# EAGLE schematic MCU (EAGLE 9.6.1)
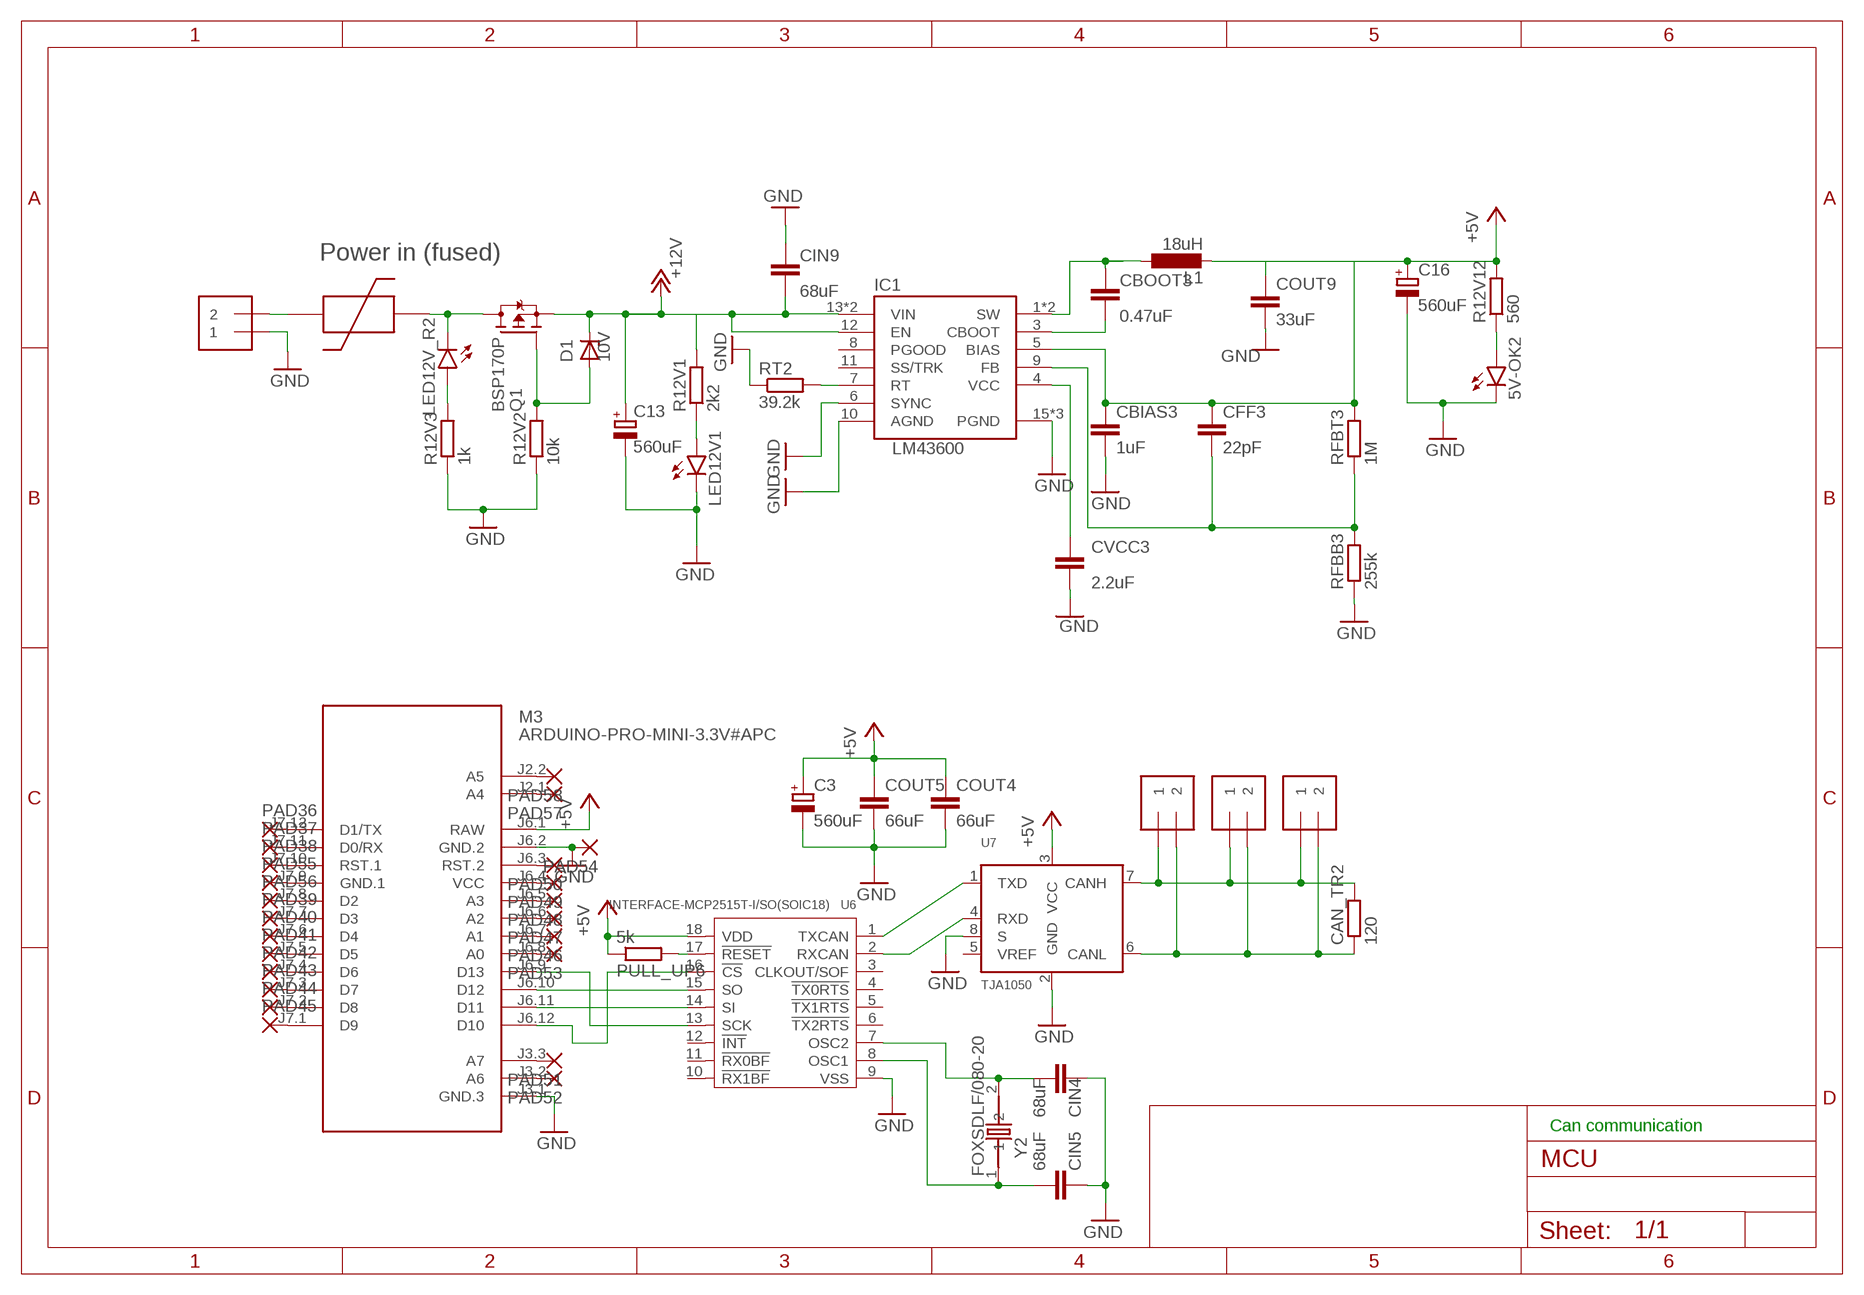
[diagram p0: schematic, sheet 1]

## Parts
5V-OK2  LEDCHIPLED_0805  [CHIPLED_0805]
C3  560uF  CPOL-EUF  [PANASONIC_F]
C13  560uF  CPOL-EUF  [PANASONIC_F]
C16  560uF  CPOL-EUF  [PANASONIC_F]
CAN_TR2  120  R-EU_R0805  [R0805]
CBIAS3  1uF  C-EUC0805  [C0805]
CBOOT3  0.47uF  C-EUC0805  [C0805]
CFF3  22pF  C-EUC0805  [C0805]
CIN4  68uF  C-EUC0805  [C0805]
CIN5  68uF  C-EUC0805  [C0805]
CIN9  68uF  C-EUC0805  [C0805]
COUT4  66uF  C-EUC0805  [C0805]
COUT5  66uF  C-EUC0805  [C0805]
COUT9  33uF  C-EUC0805  [C0805]
CVCC3  2.2uF  C-EUC0805  [C0805]
D1  10V  ZENER-DIODESMB  [SMB]
IC1  LM43600  [HTSSOP16]
J5  1X2-3.5MM  [1X2-3.5MM]
J11  1X2-3.5MM  [1X2-3.5MM]
J12  1X2-3.5MM  [1X2-3.5MM]
J13  1X2-3.5MM  [1X2-3.5MM]
L1  18uH  L-EUL1812  [L1812]
LED12V1  LEDCHIPLED_0805  [CHIPLED_0805]
LED12V_R2  LEDCHIPLED_0805  [CHIPLED_0805]
M3  ARDUINO-PRO-MINI-3.3V#APC  [ARDUINO-PRO-MINI#APC]
PAD36  SMD2  [SMD1,27-2,54]
PAD37  SMD2  [SMD1,27-2,54]
PAD38  SMD2  [SMD1,27-2,54]
PAD39  SMD2  [SMD1,27-2,54]
PAD40  SMD2  [SMD1,27-2,54]
PAD41  SMD2  [SMD1,27-2,54]
PAD42  SMD2  [SMD1,27-2,54]
PAD43  SMD2  [SMD1,27-2,54]
PAD44  SMD2  [SMD1,27-2,54]
PAD45  SMD2  [SMD1,27-2,54]
PAD46  SMD2  [SMD1,27-2,54]
PAD47  SMD2  [SMD1,27-2,54]
PAD48  SMD2  [SMD1,27-2,54]
PAD49  SMD2  [SMD1,27-2,54]
PAD50  SMD2  [SMD1,27-2,54]
PAD51  SMD2  [SMD1,27-2,54]
PAD52  SMD2  [SMD1,27-2,54]
PAD53  SMD2  [SMD1,27-2,54]
PAD54  SMD2  [SMD1,27-2,54]
PAD55  SMD2  [SMD1,27-2,54]
PAD56  SMD2  [SMD1,27-2,54]
PAD57  SMD2  [SMD1,27-2,54]
PAD58  SMD2  [SMD1,27-2,54]
PULL_UP6  5k  R-EU_R0805  [R0805]
Q1  BSP170P  [SOT223]
R12V1  2k2  R-EU_R0805  [R0805]
R12V2  10k  R-EU_R0805  [R0805]
R12V3  1k  R-EU_R0805  [R0805]
R12V12  560  R-EU_R0805  [R0805]
RFBB3  255k  R-EU_R0805  [R0805]
RFBT3  1M  R-EU_R0805  [R0805]
RT2  39.2k  R-EU_R0805  [R0805]
U6  INTERFACE-MCP2515T-I/SO(SOIC18)  [SOIC18-1.27-11.5X7.5MM]
U7  TJA1050  [SOT96-1]
U$2  SMF_OMNI-BLOK_FUSE_BLOCK  [SMF_OMNI-BLOK_FUSE_BLOCK]
Y2  FOXSDLF/080-20  [XTAL1170X500X450]

## Nets
+5V [signal]: C3.+ C16.+ CBIAS3.1 CFF3.1 COUT4.1 COUT5.1 COUT9.1 IC1.5(BIAS) L1.2 M3.J6.1(RAW) PULL_UP6.1 R12V12.2 RFBT3.2 U6.18(VDD) U7.3(VCC)
GND: 5V-OK2.C C3.- C13.- C16.- CBIAS3.2 CIN4.1 CIN5.1 CIN9.1 COUT4.2 COUT5.2 COUT9.2 CVCC3.2 IC1.6(SYNC) IC1.10(AGND) IC1.15(PGND) IC1.16(PGND) IC1.17(PGND) J13.1 LED12V1.C M3.J3.1(GND.3) M3.J6.2(GND.2) PAD54.1(P) R12V2.1 R12V3.1 RFBB3.1 RT2.1 U6.9(VSS) U7.2(GND) U7.8(S)
N$13 [12V]: CIN9.2 IC1.12(EN) IC1.13(VIN) IC1.14(VIN) R12V1.2 ; supply symbol labelled +12V
N$61: M3.J6.10(D12) U6.15(SO)
N$62: M3.J6.11(D11) U6.14(SI)
N$63: M3.J6.12(D10) U6.16(!CS)
N$64: M3.J6.9(D13) U6.13(SCK)
N$104: PULL_UP6.2 U6.17(!RESET)
N$105: U6.1(TXCAN) U7.1(TXD)
N$106: CIN4.2 U6.7(OSC2) Y2.2
N$107: CIN5.2 U6.8(OSC1) Y2.1
N$108: U6.2(RXCAN) U7.4(RXD)
N$109: CAN_TR2.2 J5.1 J11.1 J12.1 U7.7(CANH)
N$110: CAN_TR2.1 J5.2 J11.2 J12.2 U7.6(CANL)
N$111: M3.J7.12(D1/TX) PAD36.1(P)
N$112: M3.J7.11(D0/RX) PAD37.1(P)
N$113: M3.J7.10(RST.1) PAD38.1(P)
N$114: M3.J7.7(D3) PAD39.1(P)
N$115: M3.J7.6(D4) PAD40.1(P)
N$116: M3.J7.5(D5) PAD41.1(P)
N$117: M3.J7.4(D6) PAD42.1(P)
N$118: M3.J7.3(D7) PAD43.1(P)
N$119: M3.J7.2(D8) PAD44.1(P)
N$120: M3.J7.1(D9) PAD45.1(P)
N$121: M3.J6.7(A1) PAD46.1(P)
N$122: M3.J6.6(A2) PAD47.1(P)
N$123: M3.J6.5(A3) PAD48.1(P)
N$124: M3.J6.4(VCC) PAD49.1(P)
N$125: M3.J6.3(RST.2) PAD50.1(P)
N$126: M3.J3.3(A7) PAD51.1(P)
N$127: M3.J3.2(A6) PAD52.1(P)
N$128: M3.J6.8(A0) PAD53.1(P)
N$129: M3.J7.9(GND.1) PAD55.1(P)
N$130: CBOOT3.1 IC1.1(SW) IC1.2(SW) L1.1
N$131: CBOOT3.2 IC1.3(CBOOT)
N$132: LED12V1.A R12V1.1
N$133 [12V]: D1.A Q1.1(G) R12V2.2
N$134: 5V-OK2.A R12V12.1
N$135: J13.2 U$2.PIN1
N$136: LED12V_R2.A R12V3.2
N$137: LED12V_R2.C Q1.2(D) Q1.4(D) U$2.PIN2
N$138: CVCC3.1 IC1.4(VCC)
N$139: IC1.7(RT) RT2.2
N$140: CFF3.2 IC1.9(FB) RFBB3.2 RFBT3.1
N$141 [12V]: C13.+ D1.C Q1.3(S)
N$142: M3.J7.8(D2) PAD56.1(P)
N$143: M3.J2.1(A4) PAD57.1(P)
N$144: M3.J2.2(A5) PAD58.1(P)
Unconnected: IC1.8(PGOOD) IC1.11(SS/TRK) U6.3(CLKOUT/SOF) U6.4(!TX0RTS) U6.5(!TX1RTS) U6.6(!TX2RTS) U6.10(!RX1BF) U6.11(!RX0BF) U6.12(!INT) U7.5(VREF)

## Notes on the sheet
- Power in (fused)
- Can communication

## Library data of the parts
5V-OK2 LED12V1 LED12V_R2 = led:LED: LED OSRAM: - CHIPLED LG R971, LG N971, LY N971, LG Q971, LY Q971, LO R971, LY R971 LH N974, LH R974 LS Q976, LO Q976, LY Q976 LO Q996 - Hyper CHIPLED LW Q18S LB Q993, LB Q99A, LB R99A - SideLED LS A670, LO A670, LY A670, LG A670, LP A670 LB A673, LV A673, LT A673, LW A673 LH A674 LY A675 LS A676, LA A676, LO A676, LY A676, LW A676 LS A679, LY A679, LG A679 - Hyper Micro SIDELED® LS Y876, LA Y876, LO Y876, LY Y876 LT Y87S - SmartLED LW L88C, LW L88S LB L89C, LB L89S, LG L890 LS L89K, LO L89K, LY L89K LS L896, LA L896, LO L896, LY L896 - TOPLED LS T670, LO T670, LY T670, LG T670, LP T670 LSG T670, LSP T670, LSY T670, LOP T670, LYG T670 LG T671, LOG T671, LSG T671 LB T673, LV T673, LT T673, LW T673 LH T674 LS T676, LA T676, LO T676, LY T676, LB T676, LH T676, LSB T676, LW T676 LB T67C, LV T67C, LT T67C, LS T67K, LO T67K, LY T67K, LW E67C LS E67B, LA E67B, LO E67B, LY E67B, LB E67C, LV E67C, LT E67C LW T67C LS T679, LY T679, LG T679 LS T770, LO T770, LY T770, LG T770, LP T770 LB T773, LV T773, LT T773, LW T773 LH T774 LS E675, LA E675, LY E675, LS T675 LS T776, LA T776, LO T776, LY T776, LB T776 LHGB T686 LT T68C, LB T68C - Hyper Mini TOPLED® LB M676 - Mini TOPLED Santana® LG M470 LS M47K, LO M47K, LY M47K Source: http://www.osram.convergy.de LUXEON: - LUMILED® LXK2-PW12-R00, LXK2-PW12-S00, LXK2-PW14-U00, LXK2-PW14-V00 LXK2-PM12-R00, LXK2-PM12-S00, LXK2-PM14-U00 LXK2-PE12-Q00, LXK2-PE12-R00, LXK2-PE12-S00, LXK2-PE14-T00, LXK2-PE14-U00 LXK2-PB12-K00, LXK2-PB12-L00, LXK2-PB12-M00, LXK2-PB14-N00, LXK2-PB14-P00, LXK2-PB14-Q00 LXK2-PR12-L00, LXK2-PR12-M00, LXK2-PR14-Q00, LXK2-PR14-R00 LXK2-PD12-Q00, LXK2-PD12-R00, LXK2-PD12-S00 LXK2-PH12-R00, LXK2-PH12-S00 LXK2-PL12-P00, LXK2-PL12-Q00, LXK2-PL12-R00 Source: www.luxeon.com KINGBRIGHT: KA-3528ASYC Source: www.kingbright.com
C3 C13 C16 = rcl:CPOL-EU: POLARIZED CAPACITOR, European symbol; SPICEPREFIX: C
CAN_TR2 PULL_UP6 R12V1-R12V3 R12V12 RFBB3 RFBT3 RT2 = rcl:R-EU_: RESISTOR, European symbol; SPICEPREFIX: R
CBIAS3 CBOOT3 CFF3 CIN4 CIN5 CIN9 COUT4 COUT5 COUT9 CVCC3 = rcl:C-EU: CAPACITOR, European symbol; SPICEPREFIX: C
D1 = diode:ZENER-DIODE: Z-Diode
IC1 = texas-lm43600:LM43600: The LM43600 SIMPLE SWITCHER® regulator is an easy to use synchronous step-down DC-DC converter capable of driving up to 0.5 A of load current from an input voltage ranging from 3.5 V to 36 V (42 V transient). The LM43600 provides exceptional efficiency, output accuracy and drop-out voltage in a very small solution size. The library has been designed by Richard Magdycz <https://www.facebook.com/groups/eaglecadsoftUK>
J5 J11-J13 = adafruit:1X2: 3.5mm Terminal block http://www.ladyada.net/library/pcb/eaglelibrary.html
L1 = rcl:L-EU: INDUCTOR, European symbol; SPICEPREFIX: L
M3 = diy-modules:ARDUINO-PRO-MINI-*#APC: Arduino Pro Mini (and compatible devices) with angle programming connector More details available here: https://www.arduino.cc/en/Main/ArduinoBoardProMini Click here to find device on ebay.com <http://www.ebay.com/sch/arduino+pro+mini>
PAD36-PAD58 = wirepad:SMD2: SMD PAD
Q1 = transistor-fet:BSP170P: SIPMOS(R) Small-Signal-Transistor P-Channel, Enhancement mode Source: http://www.infineon.com/upload/Document/BSP170P_Rev2.4.pdf
U6 = INTERFACE-MCP2515T-I_SO_SOIC18_:INTERFACE-MCP2515T-I/SO(SOIC18): 310070025; AVAILABILITY: Unavailable; DESCRIPTION: CANbus Controller CAN 2.0 SPI Interface 18-SOIC; MF: Microchip; MP: MCP2515T-I/SO; PACKAGE: SOIC-18 Microchip; PRICE: None
U7 = TJA1050:TJA1050: High speed CAN transceiver The TJA1050 is the interface between the Controller Area Network (CAN) protocol controller and the physical bus. The device provides differential transmit capability to the bus and differential receive capability to the CAN controller. The TJA1050 is the third Philips high-speed CAN transceiver after the PCA82C250 and the PCA82C251. The most important differences are: Much lower electromagnetic emission due to optimal matching of the output signals CANH and CANL Improved behaviour in case of an unpowered node No standby mode. This makes the TJA1050 eminently suitable for use in nodes that are in a power-down situation in partially powered networks. AAL Eindhoven MK; AVAILABILITY: Unavailable; DESCRIPTION: 1/1 Transceiver Half CANbus 8-SO; MF: NXP USA; MP: TJA1050; PACKAGE: SOIC-8 NXP USA; PRICE: None
U$2 = SMF_OMNI-BLOK_FUSE_BLOCK:SMF_OMNI-BLOK_FUSE_BLOCK
Y2 = FOXSDLF_080-20:FOXSDLF/080-20: Crystal 8MHz 30ppm (Tol) 50ppm (Stability) 20pF FUND 80Ohm 2-Pin HC-49/SDLF SMD T/R; AVAILABILITY: Unavailable; DESCRIPTION: 8MHz ±30ppm Crystal 20pF 80 Ohms HC-49/US; MF: Fox Electronics; MP: FOXSDLF/080-20; PACKAGE: HC-49/US Fox Electronics; PRICE: None

## Net classes
1 signal: width 0.3 mm, drill 0.4 mm, clearance 0.25 mm
2 12V: width 1 mm, drill 1.1 mm, clearance 0.25 mm